# Altium project EVK-IRIS-W1-Mikro-Bus.PrjPcb (part 5 of 5)

## Sheet EVK-IRIS-W1-SRAM_RESET_STRAPING.SchDoc: Top Level Design
size A3; CompanyName: Rigado, LLC; Organization: Rigado; DocumentNumber: 11; SheetNumber: 11; SheetTotal: 14; Website: www.rigado.com; SheetSize: B
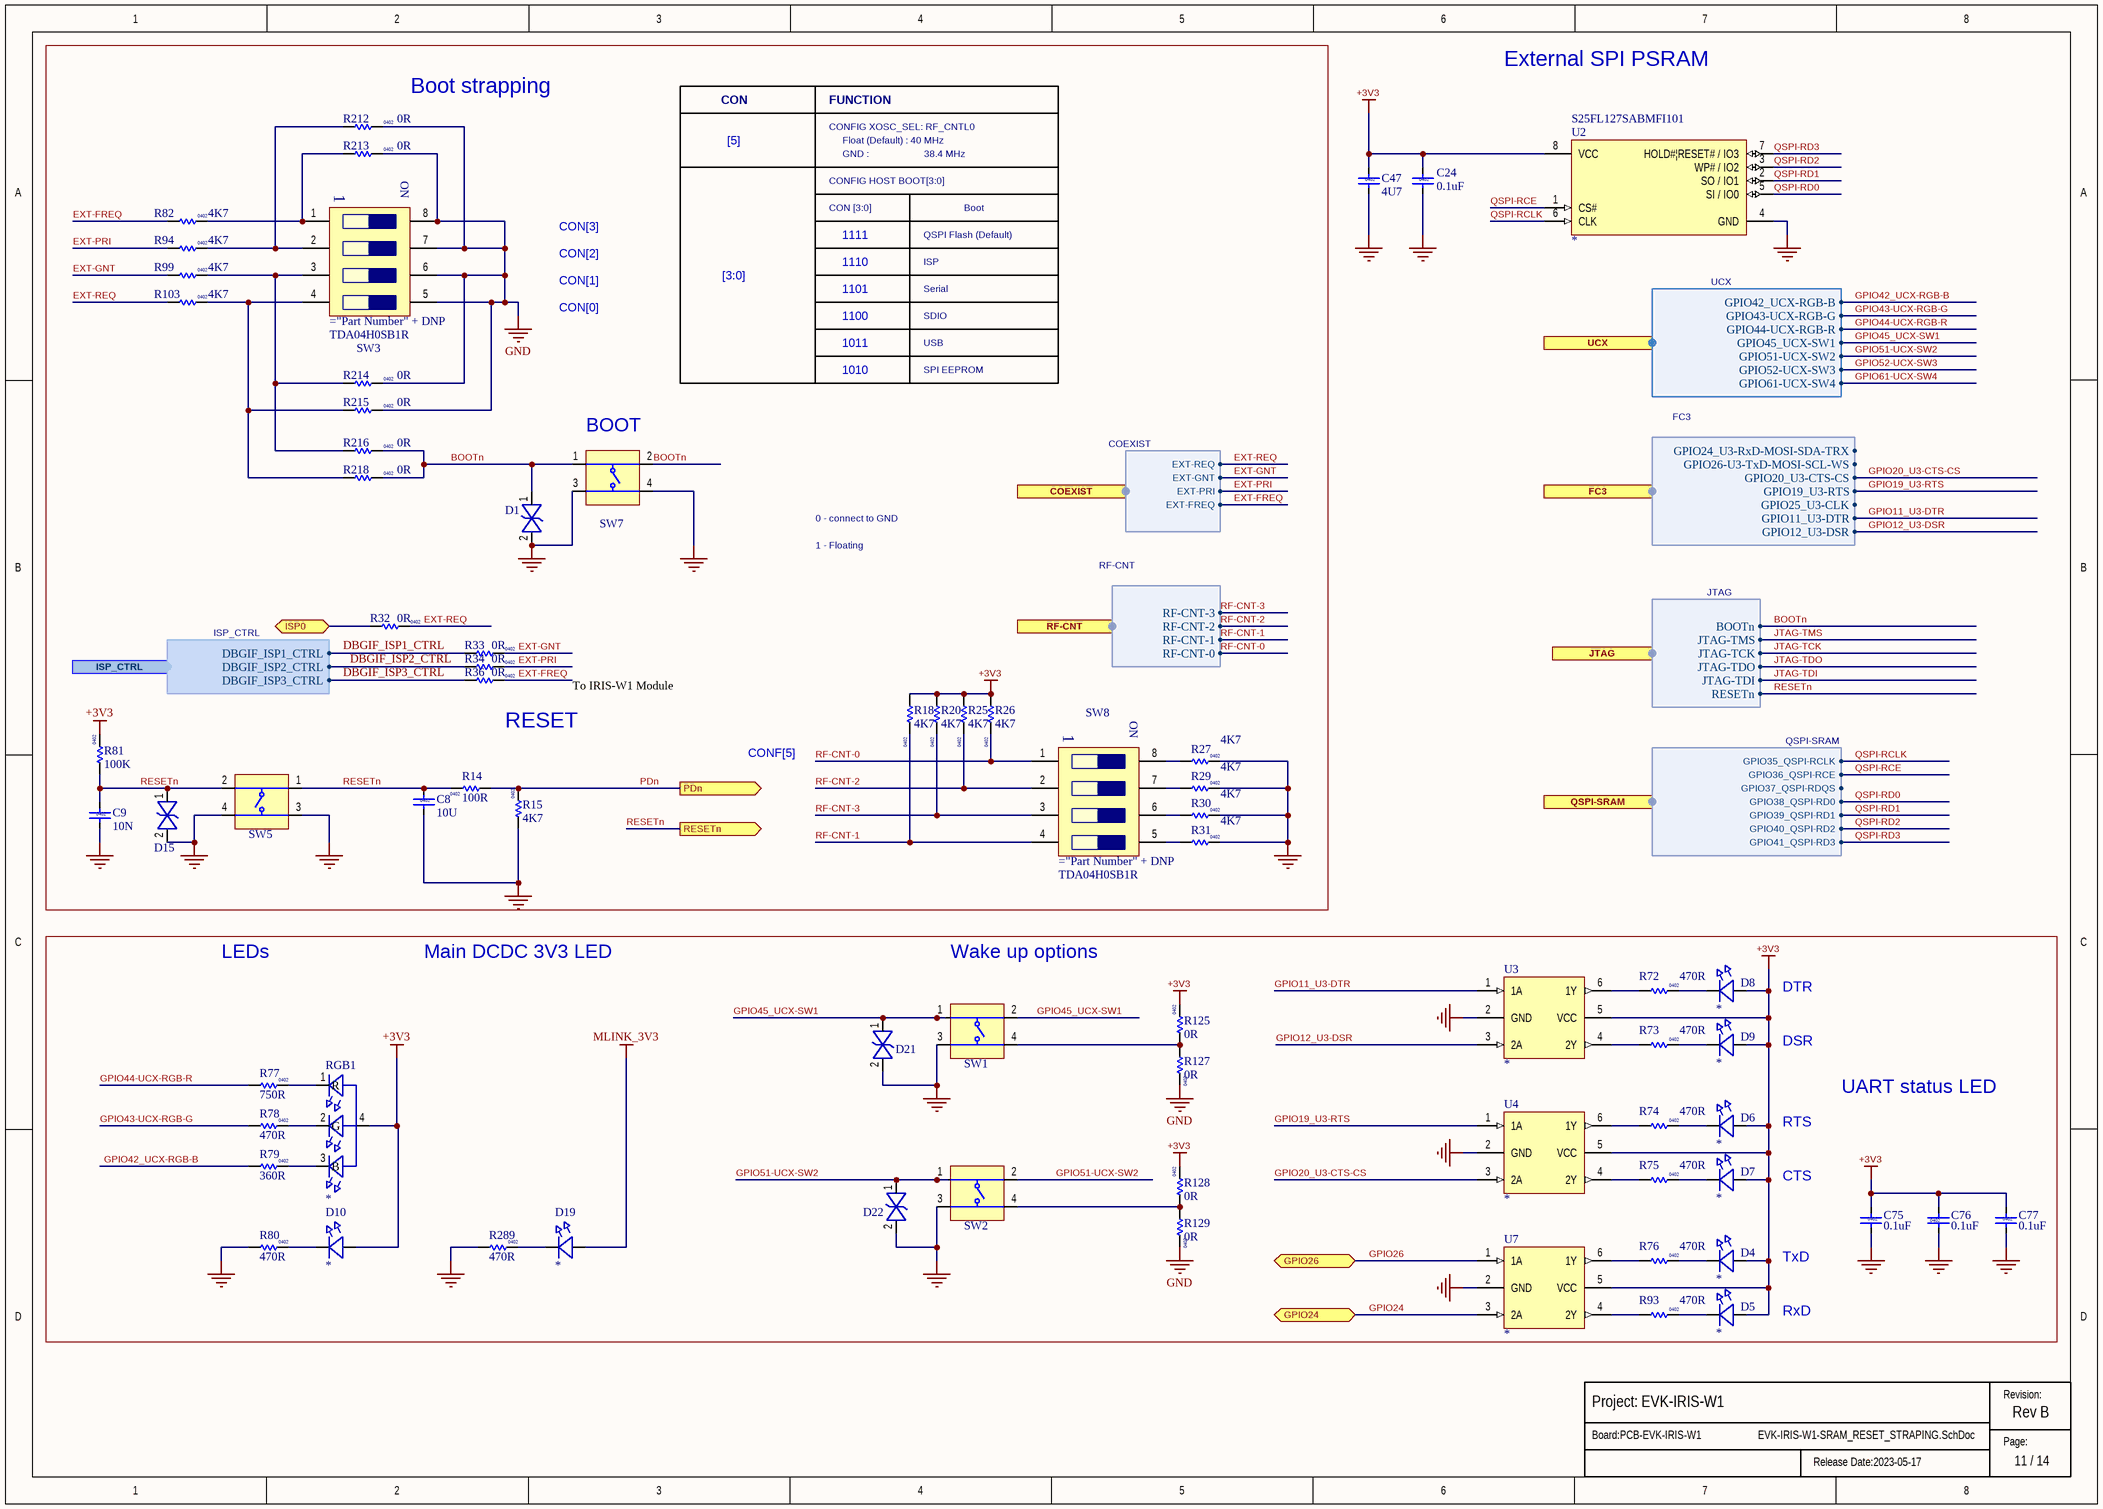
[diagram p13: EVK-IRIS-W1-SRAM_RESET_STRAPING.SchDoc]

### Parts
C8  value 10U  Size: 0402  [Cap 0402 HD]
C9  value 10N  Size: 0402  [Cap 0402]
C24  value 0.1uF  Size: 0402  [Cap 0402 HD]
C47  value 4U7  Size: 0402  [Cap 0402 HD]
C75  value 0.1uF  Size: 0402  [Cap 0402 HD]
C76  value 0.1uF  Size: 0402  [Cap 0402 HD]
C77  value 0.1uF  Size: 0402  [Cap 0402 HD]
D1  (no value)  [SOD-923]
D4  (no value)  [LED-0603]
D5  (no value)  [LED-0603]
D6  (no value)  [LED-0603]
D7  (no value)  [LED-0603]
D8  (no value)  [LED-0603]
D9  (no value)  [LED-0603]
D10  (no value)  [LED-0603]
D15  (no value)  [SOD-923]
D19  (no value)  [LED-0603]
D21  (no value)  [SOD-923]
D22  (no value)  [SOD-923]
R14  value 100R  Size: 0402  [RES 0402 HD]
R15  value 4K7  Size: 0402  [RES 0402 HD]
R18  value 4K7  Size: 0402  [RES 0402 HD]
R20  value 4K7  Size: 0402  [RES 0402 HD]
R25  value 4K7  Size: 0402  [RES 0402 HD]
R26  value 4K7  Size: 0402  [RES 0402 HD]
R27  value 4K7  Size: 0402  [RES 0402 HD]
R29  value 4K7  Size: 0402  [RES 0402 HD]
R30  value 4K7  Size: 0402  [RES 0402 HD]
R31  value 4K7  Size: 0402  [RES 0402 HD]
R32  value 0R  Size: 0402  [RES 0402 HD]
R33  value 0R  Size: 0402  [RES 0402 HD]
R34  value 0R  Size: 0402  [RES 0402 HD]
R36  value 0R  Size: 0402  [RES 0402 HD]
R72  value 470R  Size: 0402  [RES 0402 HD]
R73  value 470R  Size: 0402  [RES 0402 HD]
R74  value 470R  Size: 0402  [RES 0402 HD]
R75  value 470R  Size: 0402  [RES 0402 HD]
R76  value 470R  Size: 0402  [RES 0402 HD]
R77  value 750R  Size: 0402  [RES 0402 HD]
R78  value 470R  Size: 0402  [RES 0402 HD]
R79  value 360R  Size: 0402  [RES 0402 HD]
R80  value 470R  Size: 0402  [RES 0402 HD]
R81  value 100K  Size: 0402  [RES 0402 HD]
R82  value 4K7  Size: 0402  [RES 0402 HD]
R93  value 470R  Size: 0402  [RES 0402 HD]
R94  value 4K7  Size: 0402  [RES 0402 HD]
R99  value 4K7  Size: 0402  [RES 0402 HD]
R103  value 4K7  Size: 0402  [RES 0402 HD]
R125  value 0R  Size: 0402  [RES 0402 HD]
R127  value 0R  Size: 0402  [RES 0402 HD]
R128  value 0R  Size: 0402  [RES 0402 HD]
R129  value 0R  Size: 0402  [RES 0402 HD]
R212  value 0R  Size: 0402  [RES 0402 HD]
R213  value 0R  Size: 0402  [RES 0402 HD]
R214  value 0R  Size: 0402  [RES 0402 HD]
R215  value 0R  Size: 0402  [RES 0402 HD]
R216  value 0R  Size: 0402  [RES 0402 HD]
R218  value 0R  Size: 0402  [RES 0402 HD]
R289  value 470R  Size: 0402  [RES 0402 HD]
RGB1  (no value)  [LED_1616]
SW1  (no value)  [SW_TACT_SMT_6mm]
SW2  (no value)  [SW_TACT_SMT_6mm]
SW3  (no value)  [SOP1.27P6.2x6.2-8Pin]
SW5  (no value)  [SW_TACT_SMT_6mm]
SW7  (no value)  [SW_TACT_SMT_6mm]
SW8  (no value)  [SOP1.27P6.2x6.2-8Pin]
U2  Manufacturer Part Number 1: S25FL127SABMFI101  [SOIC-8W]
U3  (no value)  [SC70-6]
U4  (no value)  [SC70-6]
U7  (no value)  [SC70-6]

### Ports
COEXIST (harness COEXIST), FC3 (harness FC3), GPIO24 (bidir), GPIO26 (bidir), ISP0 (bidir), ISP_CTRL (harness ISP_CTRL), JTAG (harness JTAG), PDn (out), QSPI-SRAM (harness QSPI-SRAM), RESETn (out), RF-CNT (harness RF-CNT), UCX (harness UCX)

### Harnesses
QSPI-SRAM: GPIO35_QSPI-RCLK, GPIO36_QSPI-RCE, GPIO37_QSPI-RDQS, GPIO38_QSPI-RD0, GPIO39_QSPI-RD1, GPIO40_QSPI-RD2, GPIO41_QSPI-RD3
COEXIST: EXT-REQ, EXT-GNT, EXT-PRI, EXT-FREQ
RF-CNT: RF-CNT-0, RF-CNT-1, RF-CNT-2, RF-CNT-3
ISP_CTRL: DBGIF_ISP1_CTRL, DBGIF_ISP2_CTRL, DBGIF_ISP3_CTRL
UCX: GPIO42_UCX-RGB-B, GPIO43-UCX-RGB-G, GPIO44-UCX-RGB-R, GPIO45_UCX-SW1, GPIO51-UCX-SW2, GPIO52-UCX-SW3, GPIO61-UCX-SW4
FC3: GPIO20_U3-CTS-CS, GPIO19_U3-RTS, GPIO24_U3-RxD-MOSI-SDA-TRX, GPIO26-U3-TxD-MOSI-SCL-WS, GPIO25_U3-CLK, GPIO11_U3-DTR, GPIO12_U3-DSR
JTAG: JTAG-TCK, JTAG-TDI, JTAG-TDO, JTAG-TMS, RESETn, BOOTn

### Nets
+3V3: C24.1 C47.1 C75.1 C76.1 C77.1 D4.2(A) D5.2(A) D6.2(A) D7.2(A) D8.2(A) D9.2(A) D10.2(A) R18.2 R20.2 R25.2 R26.2 R81.2 R125.2 R128.2 RGB1.4(A) U2.8(VCC) U3.5(VCC) U4.5(VCC) U7.5(VCC)
GND: C8.2 C9.2 C24.2 C47.2 C75.2 C76.2 C77.2 D1.2 D15.2 D21.2 D22.2 R15.1 R27.2 R29.2 R30.2 R31.2 R80.1 R127.2 R129.2 R212.2 R213.2 R214.2 R215.2 R289.1 SW1.3(T3) SW2.3(T3) SW3.5 SW3.6 SW3.7 SW3.8 SW5.3(T3) SW5.4(T3) SW7.3(T3) SW7.4(T3) U2.4(GND) U3.2(GND) U4.2(GND) U7.2(GND)
MLINK_3V3: D19.2(A)
BOOTn: D1.1 R216.2 R218.2 SW7.1(T1) SW7.2(T2) ; port JTAG.BOOTn
DBGIF_ISP0_CTRL: R32.1 ; port ISP0
DBGIF_ISP1_CTRL: R33.1 ; port ISP_CTRL.DBGIF_ISP1_CTRL
DBGIF_ISP2_CTRL: R34.1 ; port ISP_CTRL.DBGIF_ISP2_CTRL
DBGIF_ISP3_CTRL: R36.1 ; port ISP_CTRL.DBGIF_ISP3_CTRL
EXT-FREQ: R36.2 R82.1 ; port COEXIST.EXT-FREQ
EXT-GNT: R33.2 R99.1 ; port COEXIST.EXT-GNT
EXT-PRI: R34.2 R94.1 ; port COEXIST.EXT-PRI
EXT-REQ: R32.2 R103.1 ; port COEXIST.EXT-REQ
GPIO11_U3-DTR: U3.1(1A) ; port FC3.GPIO11_U3-DTR
GPIO12_U3-DSR: U3.3(2A) ; port FC3.GPIO12_U3-DSR
GPIO19_U3-RTS: U4.1(1A) ; port FC3.GPIO19_U3-RTS
GPIO20_U3-CTS-CS: U4.3(2A) ; port FC3.GPIO20_U3-CTS-CS
GPIO24: U7.3(2A) ; port GPIO24
GPIO26: U7.1(1A) ; port GPIO26
GPIO42_UCX-RGB-B: R79.1 ; port UCX.GPIO42_UCX-RGB-B
GPIO43-UCX-RGB-G: R78.1 ; port UCX.GPIO43-UCX-RGB-G
GPIO44-UCX-RGB-R: R77.1 ; port UCX.GPIO44-UCX-RGB-R
GPIO45_UCX-SW1: D21.1 SW1.1(T1) SW1.2(T2) ; port UCX.GPIO45_UCX-SW1
GPIO51-UCX-SW2: D22.1 SW2.1(T1) SW2.2(T2) ; port UCX.GPIO51-UCX-SW2
PDn: R14.1 R15.2 ; port PDn
QSPI-RCE: U2.1(CS#) ; port QSPI-SRAM.GPIO36_QSPI-RCE
QSPI-RCLK: U2.6(CLK) ; port QSPI-SRAM.GPIO35_QSPI-RCLK
QSPI-RD0: U2.5(SI_/_IO0) ; port QSPI-SRAM.GPIO38_QSPI-RD0
QSPI-RD1: U2.2(SO_/_IO1) ; port QSPI-SRAM.GPIO39_QSPI-RD1
QSPI-RD2: U2.3(WP#_/_IO2) ; port QSPI-SRAM.GPIO40_QSPI-RD2
QSPI-RD3: U2.7(HOLD#|RESET#_/_IO3) ; port QSPI-SRAM.GPIO41_QSPI-RD3
RESETn: C8.1 C9.1 D15.1 R14.2 R81.1 SW5.1(T1) SW5.2(T2) ; port RESETn, port JTAG.RESETn
RF-CNT-0: R26.1 SW8.1 ; port RF-CNT.RF-CNT-0
RF-CNT-1: R18.1 SW8.4 ; port RF-CNT.RF-CNT-1
RF-CNT-2: R25.1 SW8.2 ; port RF-CNT.RF-CNT-2
RF-CNT-3: R20.1 SW8.3 ; port RF-CNT.RF-CNT-3
NetD4_1: D4.1(C) R76.2
NetD5_1: D5.1(C) R93.2
NetD6_1: D6.1(C) R74.2
NetD7_1: D7.1(C) R75.2
NetD8_1: D8.1(C) R72.2
NetD9_1: D9.1(C) R73.2
NetD10_1: D10.1(C) R80.2
NetD19_1: D19.1(C) R289.2
NetR27_1: R27.1 SW8.8
NetR29_1: R29.1 SW8.7
NetR30_1: R30.1 SW8.6
NetR31_1: R31.1 SW8.5
NetR72_1: R72.1 U3.6(1Y)
NetR73_1: R73.1 U3.4(2Y)
NetR74_1: R74.1 U4.6(1Y)
NetR75_1: R75.1 U4.4(2Y)
NetR76_1: R76.1 U7.6(1Y)
NetR77_2: R77.2 RGB1.1(R)
NetR78_2: R78.2 RGB1.2(G)
NetR79_2: R79.2 RGB1.3(B)
NetR82_2: R82.2 R213.1 SW3.1
NetR93_1: R93.1 U7.4(2Y)
NetR94_2: R94.2 R212.1 SW3.2
NetR99_2: R99.2 R214.1 R216.1 SW3.3
NetR103_2: R103.2 R215.1 R218.1 SW3.4
NetR125_1: R125.1 R127.1 SW1.4(T3)
NetR128_1: R128.1 R129.1 SW2.4(T3)

### Notes on the sheet
- Boot strapping
- CON
- FUNCTION
- External SPI PSRAM
- [5]
- CONFIG XOSC_SEL: RF_CNTL0
- CONFIG HOST BOOT[3:0]
- Float (Default) : 40 MHz
- GND :                      38.4 MHz
- CON[3]
- CON [3:0]
- 1111
- QSPI Flash (Default)
- Boot
- CON[2]
- CON[1]
- CON[0]
- [3:0]
- 1110
- 1101
- 1100
- SDIO
- Serial
- ISP
- 1011
- 1010
- USB
- SPI EEPROM
- (near SW7) BOOT
- 0 - connect to GND
- 1 - Floating
- To IRIS-W1 Module
- RESET
- CONF[5]
- LEDs
- Main DCDC 3V3 LED
- Wake up options
- DTR
- DSR
- RTS
- UART status LED
- CTS
- TxD
- RxD
- Revision:
- Page:
- (in symbol 137-00012) ON

### Library data of the parts
C8 = UBXH01-0000244: CAP CER X5R 0402 10U 20% 10V; Manufacturer: Murata Manufacturing Company, Ltd.; Manufacturer P/N: GRM155R61A106ME11; Editor: dario.antonaz; Released by: jure.podmenik; Env: ROHS; Permitted Use: Volume Products; Perferred: PREF; Mfg P/N Status: Active; Mfg P/N Split: 0; Mfg P/N Released: Yes; Part Number: UBXH01-0000244; Tolerance: 20%; Max Voltage: 10V; Part Type: Capacitor; Release Data: 2016-03-11T16:15:50; UBX Wiki: https://wiki.u-blox.com/bin/view/Operations/PartDetails?index=24334; RefDes: C; Mfg P/N Datasheet: https://wiki.u-blox.com/bin/view/Generic/Docs/DocumentSummary?index=24333; Manufacturer 2: Samsung Electro-Mechanics; Manufacturer P/N 2: CL05A106MP5NUN; Mfg P/N Status 2: NRND; Mfg P/N Split 2: 0; Mfg P/N Released 2: Yes; Mfg P/N Datasheet 2: https://wiki.u-blox.com/bin/view/Generic/Docs/DocumentSummary?index=27636
C9 = UBXH01-0023025: CAP CER X7R 0402 10N 10% 16V; Manufacturer: Murata Manufacturing Company, Ltd.; Manufacturer P/N: GRM155R71C103KA01; Editor: roland.rust; Released by: anthony.gergis; Env: ROHS; Permitted Use: Volume Products; Perferred: PREF; Mfg P/N Status: NRND; Mfg P/N Split: 100; Mfg P/N Released: Yes; Part Number: UBXH01-0023025; Tolerance: 10%; Max Voltage: 16V; Min Operating Temp: -55°C; Max Operating Temp: 125°C; Part Type: Capacitor; Release Data: 2021-02-16T13:14:11; UBX Wiki: https://wiki.u-blox.com/bin/view/Operations/PartDetails?index=5491; RefDes: C; Manufacturer 2: Samsung Electro-Mechanics; Manufacturer P/N 2: CL05B103KO5NNNC; Mfg P/N Status 2: Active; Mfg P/N Split 2: 0; Mfg P/N Released 2: Yes; Mfg P/N Datasheet 2: https://wiki.u-blox.com/bin/view/Generic/Docs/DocumentSummary?index=28567
C24 C75-C77 = 120-00016: Cap, Ceramic 0.1uF 10V 10% X5R 0402; Part Name: CAP CER 0.1UF 10V 10% X5R 0402; Manufacturer 1: Murata Electronics North America; Manufacturer Part Number 1: GRM155R61A104KA01J; Tolerance: +/- 10%; Use in new designs: Yes; UBX Code: None; Item Phase: In Production; Part Number: 120-00016; Revision: 0A; Supplier 1: Digi-Key; Supplier Part Number 1: 490-6297-1-ND; Manufacturer 2: Yageo; Supplier 2: Digi-Key; Supplier Part Number 2: 311-1336-1-ND; Height: 0.55mm; Pins: 2; Temperature Coefficient: X5R; Voltage: 10V; Max Operating Temp: 85; Manufacturer Part Number 2: CC0402KRX5R6BB104; Min Operating Temp: -55
C47 = UBXH01-0000243: CAP CER X5R 0402 4U7 20% 10V; Manufacturer: Murata Manufacturing Company, Ltd.; Manufacturer P/N: GRM155R61A475MEAA; Editor: martin.pilik; Released by: fabrice.bret-dibat; Env: GREEN; Permitted Use: Volume Products; Perferred: PREF; Mfg P/N Status: Active; Mfg P/N Split: 100; Mfg P/N Released: Yes; Part Number: UBXH01-0000243; Tolerance: 20%; Max Voltage: 10V; Min Operating Temp: -40°C; Max Operating Temp: 85°C; Part Type: Capacitor; Release Data: 2021-05-10T12:57:47; UBX Wiki: https://wiki.u-blox.com/bin/view/Operations/PartDetails?index=24303; RefDes: C; Mfg P/N Datasheet: https://wiki.u-blox.com/bin/view/Generic/Docs/DocumentSummary?index=24302
D1 D15 D21 D22 = 110-00019: Diode, ESD9B, 3.3V, ST5G, SOD-923; Part Name: Diode TVS 3.3V SOD-923; Manufacturer 1: ON Semiconductor; Manufacturer Part Number 1: ESD9B3.3ST5G; Body Size: 0.8mm x 0.6mm; Use in new designs: Yes; UBX Code: None; Item Phase: In Production; Part Number: 110-00019; Supplier 1: Digi-Key; Supplier Part Number 1: ESD9B3.3ST5GOSCT-ND; Height: 0.4mm; MFG Package: SOD-923; Pins: 2; Voltage: 3.3V; Manufacturer 2: ON Semiconductor; Max Operating Temp: 150; Supplier 2: Arrow; Supplier Part Number 2: ESD9B3.3ST5G; Manufacturer Part Number 2: ESD9B3.3ST5G; Current: None; Min Operating Temp: -55; Revision: 0A
D4-D10 D19 = UBXH11-0000018: LED CHIP 0603 LOW CURRENT OSRAM 0.002A GREEN 2.2V 2mA; Manufacturer P/N: LG L29K-G2J1-24; Editor: johann.furrer; Released by: martin.grasse; Env: ROHS; Permitted Use: Volume Products; Perferred: PREF; Mfg P/N Status: Active; Mfg P/N Split: 100; Mfg P/N Released: Yes; Color: *; Part Number: UBXH11-0000018; Value: GREEN; Max Voltage: 2.2V; Max Current: 2mA; Size: 0603; Min Operating Temp: -40°C; Max Operating Temp: 85°C; Part Type: LED; Release Data: 2018-01-09T15:31:38; UBX Wiki: https://wiki.u-blox.com/bin/view/Operations/PartDetails?index=20619; RefDes: DS; Manufacturer: Osram; Mfg P/N Datasheet: https://wiki.u-blox.com/bin/view/Generic/Docs/DocumentSummary?index=20620
R14 = UBXH18-0000504: RES THIN FILM CHIP 0402 100R 0.1% 100mW; Manufacturer: YAGEO; Manufacturer P/N: RT0402BRD07100RL; Editor: martin.kessel; Env: ROHS; Permitted Use: Internal Use; Perferred: PREF; Mfg P/N Status: Active; Mfg P/N Split: 100; Mfg P/N Released: No; Part Number: UBXH18-0000504; Tolerance: 0.1%; Max Power: 100mW; Min Operating Temp: -55°C; Max Operating Temp: 155°C; Part Type: Resistor; UBX Wiki: https://wiki.u-blox.com/bin/view/Operations/PartDetails?index=31120; RefDes: R; Mfg P/N Datasheet: https://wiki.u-blox.com/bin/view/Generic/Docs/DocumentSummary?index=19276
R15 R18 R20 R25-R27 R29-R31 R82 R94 R99 R103 = UBXH18-0000213: RES THICK FILM CHIP 0402 4K7 1% 63mW; Manufacturer: KOA; Manufacturer P/N: RK73H1ETTP4701F; Editor: michael.hein; Released by: vasyl.dykyy; Env: ROHS; Permitted Use: Volume Products; Perferred: PREF; Mfg P/N Status: Active; Mfg P/N Split: 100; Mfg P/N Released: Yes; Part Number: UBXH18-0000213; Tolerance: 1%; Max Power: 63mW; Part Type: Resistor; Release Data: 2015-10-02T11:47:33; Automotive: Yes; UBX Wiki: https://wiki.u-blox.com/bin/view/Operations/PartDetails?index=23300; RefDes: R; Mfg P/N Datasheet: https://wiki.u-blox.com/bin/view/Generic/Docs/DocumentSummary?index=8222
R32-R34 R36 R125 R127-R129 R212-R216 R218 = UBXH18-0003002: RES THICK FILM CHIP 0402 0R 0 100mW; Manufacturer: KOA; Manufacturer P/N: RK73Z1ETTD; Tolerance: 0; Editor: charlotte.biber; Released by: peter.mueller; Env: ROHS; Permitted Use: Volume Products; Perferred: PREF; Mfg P/N Status: NRND; Mfg P/N Split: 100; Mfg P/N Released: Yes; Part Number: UBXH18-0003002; Manufacturer 2: YAGEO; Max Power: 100mW; Part Type: Resistor; Release Data: 2012-06-05T09:49:55; UBX Wiki: https://wiki.u-blox.com/bin/view/Operations/PartDetails?index=6611; RefDes: R; Manufacturer P/N 2: 2322_705_91001_L; Mfg P/N Status 2: NRND; Mfg P/N Split 2: 0; Mfg P/N Released 2: Yes
R72-R76 R78 R80 R93 R289 = UBXH18-0008041: RES THICK FILM CHIP 0402 470R 5% 100mW; Manufacturer: ROHM; Manufacturer P/N: MCR01MZPJ471; Editor: roland.rust; Env: ROHS; Permitted Use: Volume Products; Perferred: PREF; Mfg P/N Status: Active; Mfg P/N Split: 100; Mfg P/N Released: Yes; Part Number: UBXH18-0008041; Tolerance: 5%; Max Power: 100mW; Part Type: Resistor; Released by: roland.rust; Release Data: 2009-04-24T14:36:39; UBX Wiki: https://wiki.u-blox.com/bin/view/Operations/PartDetails?index=6926; RefDes: R; Manufacturer 2: KOA; Manufacturer P/N 2: RK73B1ETTP471J; Mfg P/N Status 2: Active; Mfg P/N Split 2: 0; Mfg P/N Released 2: Yes; Manufacturer 3: YAGEO; Manufacturer P/N 3: 2322_705_87471_L; Mfg P/N Status 3: NRND; Mfg P/N Split 3: 0; Mfg P/N Released 3: Yes
R77 = UBXH18-0008046: RES THICK FILM CHIP 0402 750R 5% 100mW; Manufacturer: Panasonic; Manufacturer P/N: ERJ2GEJ751X; Editor: jaka.bevk; Released by: erian.bezhani; Env: ROHS; Permitted Use: Volume Products; Perferred: PREF; Mfg P/N Status: Active; Mfg P/N Split: 100; Mfg P/N Released: Yes; Part Number: UBXH18-0008046; Tolerance: 5%; Max Power: 100mW; Part Type: Resistor; Release Data: 2014-10-03T09:31:33; UBX Wiki: https://wiki.u-blox.com/bin/view/Operations/PartDetails?index=6935; RefDes: R; Mfg P/N Datasheet: https://wiki.u-blox.com/bin/view/Generic/Docs/DocumentSummary?index=21267
R79 = UBXH18-0000216: RES THICK FILM CHIP 0402 360R 1% 63mW; Manufacturer: KOA; Manufacturer P/N: RK73H1ETTP3600F; Editor: michael.hein; Released by: vasyl.dykyy; Env: ROHS; Permitted Use: Volume Products; Perferred: PREF; Mfg P/N Status: Active; Mfg P/N Split: 100; Mfg P/N Released: Yes; Part Number: UBXH18-0000216; Tolerance: 1%; Max Power: 63mW; Part Type: Resistor; Release Data: 2015-10-02T11:55:45; Automotive: Yes; UBX Wiki: https://wiki.u-blox.com/bin/view/Operations/PartDetails?index=23306; RefDes: R; Mfg P/N Datasheet: https://wiki.u-blox.com/bin/view/Generic/Docs/DocumentSummary?index=8222
R81 = UBXH18-0008097: RES THICK FILM CHIP 0402 100K 5% 100mW; Manufacturer: YAGEO; Manufacturer P/N: 2322_705_70104_L; Editor: roland.rust; Env: ROHS; Permitted Use: Volume Products; Perferred: PREF; Mfg P/N Status: NRND; Mfg P/N Split: 100; Mfg P/N Released: Yes; Part Number: UBXH18-0008097; Tolerance: 5%; Max Power: 100mW; Part Type: Resistor; Released by: roland.rust; Release Data: 2005-07-22T13:59:44; UBX Wiki: https://wiki.u-blox.com/bin/view/Operations/PartDetails?index=7020; RefDes: R; Manufacturer 2: KOA; Manufacturer P/N 2: RK73B1ETTD104J; Mfg P/N Status 2: NRND; Mfg P/N Split 2: 0; Mfg P/N Released 2: Yes
RGB1 = 115-00026: LED RGB SMT 0606; Manufacturer 1: Lite-On Inc; Manufacturer Part Number 1: LTST-C19HE1WT; Body Size: 1.6mm x 1.6mm; Current: 20mA; Item Phase: In Production; MFG Package: 0606; Use in new designs: Yes; Voltage: None; Color: *; Part Number: 115-00026; Supplier 1: Digi-Key; Supplier Part Number 1: 160-2162-1-ND; Height: 0.35mm; Max Operating Temp: 80; Min Operating Temp: -20; Part Name: LED RGB SMT 0606; Pins: 4; Revision: 0B; Size: Other; UBX Code: None; Manufacturer 2: QT Brightek (QTB); Manufacturer Part Number 2: QBLP600-RGB; Supplier 2: Digi-Key; Supplier Part Number 2: 1516-1184-1-ND
SW1 SW2 SW5 SW7 = 135-00002: Tactile Switch, SPST-NO, SMT, Actuation force = 160g, 6mm x 6mm; Part Name: Button Tactile SPST-NO 50mA 6mm SMT; Manufacturer 1: C&K Components; Manufacturer Part Number 1: PTS645SM43SMTR92 LFS; Current: 50mA; Use in new designs: Yes; Voltage: 12VDC; UBX Code: None; Item Phase: In Production; Part Number: 135-00002; Supplier 1: Digi-Key; Supplier Part Number 1: CKN9112CT-ND; Body Size: 6mm x 6mm; Height: 4.4mm; Pins: 4; Revision: 0B; Manufacturer 2: Seeed Technology; Supplier 2: Seeed Technology; Supplier Part Number 2: Rigado 135-00002; Max Operating Temp: 60; Min Operating Temp: -20; Manufacturer Part Number 2: Rigado 135-00002
SW3 SW8 = 137-00012: Dip Switch SPST 4 Position Surface Mount Slide (Standard) Actuator 25mA 24VDC; Manufacturer 1: C&K Components; Item_Phase: Pre-Production; Component Mounting Type: SMT; Switch/Button Function: On-Off; Use in new designs: Yes; Voltage: 24V; Item Phase: Unreleased; UBX Code: None; Part Number: 137-00012; Part Name: TDA04H0SB1R; Part_Type: Switch; Revision: A; Supplier 1: Digi-Key; Supplier Part Number 1: CKN9502TR-ND; Arena Link: https://app.bom.com/a/4M5DJQ9Q9SR7OCE3?v=spec.summary; Current: 25mA; Height: 2.35mm; Length: 6.2mm; Pins: 8; Switch/Button Circuit: SPST; Width: 6.2mm; Manufacturer Part Number 1: TDA04H0SB1R; Max Operating Temp: 85; Min Operating Temp: -40; Manufacturer 2: None; Manufacturer Part Number 2: None; Supplier 2: None; Supplier Part Number 2: None
U2 = 240-00017: IC, Flash 128MBIT, 108MHz, 8SOIC; Manufacturer 1: Cypress Semiconductor Corp; Part Name: IC Flash 128MBIT 108MHz 8SOIC; Body Size: 5.28mm x 5.28mm; Interface: SPI; Item Phase: Unreleased; Memory Type: Flash - NOR; MFG Package: 8-SOIC; SMT Pitch: 1.27mm; Thermal Pad: No; Use in new designs: Yes; Voltage: 3.6V; UBX Code: None; Manufacturer P/N: *; Part Number: 240-00017; Supplier 1: Digi-Key; Supplier Part Number 1: 1274-1045-ND; Height: 2.16mm; Memory Size: 128Mbit; Memory Speed: 108MHz; Max Operating Temp: 85; Min Operating Temp: -40; Pins: 8; Revision: None; Manufacturer 2: None; Manufacturer Part Number 2: None; Supplier 2: None; Supplier Part Number 2: None
U3 U4 U7 = 225-00022: Buffer, Non-Inverting 2 Element 1 Bit per Element Push-Pull Output SC-70-6; Manufacturer 1: Texas Instruments; Manufacturer Part Number 1: SN74LVC2G34DCKR; Part Name: IC BUF NON-INVERT 5.5V SC70-6; Body Size: 1.25mm x 2mm; Item Phase: In Production; SMT Pitch: 0.65mm; Thermal Pad: No; Use in new designs: Yes; Voltage: 5.5V; UBX Code: None; Manufacturer P/N: *; Part Number: 225-00022; Supplier 1: Digi-Key; Supplier Part Number 1: 296-13497-1-ND; Height: 1.1mm; Logic Type: Buffer; MFG Package: SC-70-6; Max Operating Temp: 125; Min Operating Temp: -40; Pins: 6; Revision: 0A; Manufacturer 2: ON Semiconductor; Manufacturer Part Number 2: NC7WZ16P6X; Supplier 2: Digi-Key; Supplier Part Number 2: NC7WZ16P6XCT-ND

## Nets that join several sheets
+1V8: EVK-IRIS-W1-PIN-HEADERS_SDIO-HEADER (J70.6), EVK-IRIS-W1-PowerSchDoc (J38.L7 J115.1)
+3V3: EVK-IRIS-W1-FTDI (21 pins), EVK-IRIS-W1-PIN-HEADERS_SDIO-HEADER (5 pins), EVK-IRIS-W1-PowerSchDoc (13 pins), EVK-IRIS-W1_MikroBuses (12 pins), EVK-IRIS-W1-RMII (26 pins), EVK-IRIS-W1-MCULINK-MUX (12 pins), EVK-IRIS-W1-DEBUG INTERFACE (5 pins), EVK-IRIS-W1-MCULINK_USB_DCDC (R211.2), EVK-IRIS-W1-SRAM_RESET_STRAPING (24 pins)
+VPA: EVK-IRIS-W1-PIN-HEADERS_SDIO-HEADER (J70.5), EVK-IRIS-W1-PowerSchDoc (J38.L8 J116.1)
Chassis-GND: EVK-IRIS-W1-PowerSchDoc (J72.SHLD J98.SHLD), EVK-IRIS-W1-RMII (C50.2 R137.2 T1.Shell), EVK-IRIS-W1-DEBUG INTERFACE (TP3.1 TP5.1), EVK-IRIS-W1-MCULINK_USB_DCDC (J101.SHLD)
GND: EVK-IRIS-W1-FC2_FC3_FC14_RMII (C73.2 C74.2), EVK-IRIS-W1-FTDI (40 pins), EVK-IRIS-W1-PIN-HEADERS_SDIO-HEADER (20 pins), EVK-IRIS-W1-PowerSchDoc (109 pins), EVK-IRIS-W1_MikroBuses (20 pins), EVK-IRIS-W1_MOD (C67.2 C68.2 J40.2 J41.2), EVK-IRIS-W1-RMII (35 pins), EVK-IRIS-W1-MCULINK-MUX (16 pins), EVK-IRIS-W1-MUCLINK (54 pins), EVK-IRIS-W1-DEBUG INTERFACE (26 pins), EVK-IRIS-W1-MCULINK_USB_DCDC (33 pins), EVK-IRIS-W1-SRAM_RESET_STRAPING (38 pins)
MCU_LINK_3V3: EVK-IRIS-W1-MUCLINK (21 pins), EVK-IRIS-W1-DEBUG INTERFACE (R220.1 R221.2), EVK-IRIS-W1-MCULINK_USB_DCDC (15 pins)
MLINK_3V3: EVK-IRIS-W1-MUCLINK (11 pins), EVK-IRIS-W1-MCULINK_USB_DCDC (8 pins), EVK-IRIS-W1-SRAM_RESET_STRAPING (D19.2)
MUSB-OTG_VBUS: EVK-IRIS-W1-PowerSchDoc (8 pins), EVK-IRIS-W1_MOD (J14.2)
VBUS: EVK-IRIS-W1-PowerSchDoc (7 pins), EVK-IRIS-W1-MCULINK_USB_DCDC (D16.2)
VBUS-OUT: EVK-IRIS-W1-PIN-HEADERS_SDIO-HEADER (J3.1 J4.1 J10.1 J70.1), EVK-IRIS-W1-PowerSchDoc (6 pins), EVK-IRIS-W1_MikroBuses (8 pins), EVK-IRIS-W1-MCULINK_USB_DCDC (C97.1 R151.2 U20.1 U20.6)
VCC_IF_LINK: EVK-IRIS-W1-MUCLINK (R186.1), EVK-IRIS-W1-DEBUG INTERFACE (R13.1 R217.2)
ADC0_CH1_CURR: EVK-IRIS-W1-MUCLINK (U13.14 U13.57), EVK-IRIS-W1-MCULINK_USB_DCDC (R241.1 R242.1)
ADC1_CH1_V: EVK-IRIS-W1-MUCLINK (U13.20), EVK-IRIS-W1-MCULINK_USB_DCDC (R239.1 R240.2)
BOOTn: EVK-IRIS-W1-FTDI (R7.2), EVK-IRIS-W1-SRAM_RESET_STRAPING (5 pins)
CRSDV: EVK-IRIS-W1-FC2_FC3_FC14_RMII (R281.1), EVK-IRIS-W1-RMII (R140.1)
CTRL_CAL_DISC: EVK-IRIS-W1-MUCLINK (U13.3), EVK-IRIS-W1-MCULINK_USB_DCDC (R231.1 R232.2)
CTRL_CAL_R1: EVK-IRIS-W1-MUCLINK (U13.41), EVK-IRIS-W1-MCULINK_USB_DCDC (R227.1 R228.2)
CTRL_CAL_R2: EVK-IRIS-W1-MUCLINK (U13.42), EVK-IRIS-W1-MCULINK_USB_DCDC (R229.1 R230.1)
CTRL_HIGH_CURR: EVK-IRIS-W1-MUCLINK (U13.22 U13.94), EVK-IRIS-W1-MCULINK_USB_DCDC (R233.1 R234.1)
CTRL_HIGH_CURR_DIS: EVK-IRIS-W1-MUCLINK (U13.92), EVK-IRIS-W1-MCULINK_USB_DCDC (R237.1 R238.1)
CTRL_HIGH_CURR_EN: EVK-IRIS-W1-MUCLINK (U13.8), EVK-IRIS-W1-MCULINK_USB_DCDC (R235.1 R236.2)
DBGIF_DETECT: EVK-IRIS-W1-MUCLINK (U13.78), EVK-IRIS-W1-DEBUG INTERFACE (R224.1)
DBGIF_ISP0_CTRL: EVK-IRIS-W1-MUCLINK (U13.72), EVK-IRIS-W1-DEBUG INTERFACE (R68.1 R217.1), EVK-IRIS-W1-SRAM_RESET_STRAPING (R32.1)
DBGIF_ISP1_CTRL: EVK-IRIS-W1-MUCLINK (U13.77), EVK-IRIS-W1-MCULINK_USB_DCDC (R243.1 R245.2), EVK-IRIS-W1-SRAM_RESET_STRAPING (R33.1)
DBGIF_ISP2_CTRL: EVK-IRIS-W1-MUCLINK (U13.68), EVK-IRIS-W1-MCULINK_USB_DCDC (R246.1 R247.1), EVK-IRIS-W1-SRAM_RESET_STRAPING (R34.1)
DBGIF_ISP3_CTRL: EVK-IRIS-W1-MUCLINK (U13.80), EVK-IRIS-W1-MCULINK_USB_DCDC (R248.1 R250.2), EVK-IRIS-W1-SRAM_RESET_STRAPING (R36.1)
DBGIF_RESET: EVK-IRIS-W1-MUCLINK (U13.90), EVK-IRIS-W1-DEBUG INTERFACE (R43.2)
DBGIF_RESET_TXEN: EVK-IRIS-W1-MUCLINK (U13.71), EVK-IRIS-W1-DEBUG INTERFACE (R221.1 R223.1)
DBGIF_TCK_SWCLK: EVK-IRIS-W1-MUCLINK (U13.54), EVK-IRIS-W1-DEBUG INTERFACE (R2.2 R296.2)
DBGIF_TDI: EVK-IRIS-W1-MUCLINK (U13.7), EVK-IRIS-W1-DEBUG INTERFACE (R292.2)
DBGIF_TDO_SWO: EVK-IRIS-W1-MUCLINK (U13.83), EVK-IRIS-W1-DEBUG INTERFACE (R290.2)
DBGIF_TMS_SWDIO: EVK-IRIS-W1-MUCLINK (U13.81), EVK-IRIS-W1-DEBUG INTERFACE (R12.2 R294.2)
DBGIF_TMS_SWDIO_TXEN: EVK-IRIS-W1-MUCLINK (U13.66), EVK-IRIS-W1-DEBUG INTERFACE (R219.1 R220.2)
EXT-FREQ: EVK-IRIS-W1-PIN-HEADERS_SDIO-HEADER (J3.3), EVK-IRIS-W1_MOD (J38.M14), EVK-IRIS-W1-SRAM_RESET_STRAPING (R36.2 R82.1)
EXT-GNT: EVK-IRIS-W1-PIN-HEADERS_SDIO-HEADER (J3.4), EVK-IRIS-W1_MOD (J38.M12), EVK-IRIS-W1-SRAM_RESET_STRAPING (R33.2 R99.1)
EXT-PRI: EVK-IRIS-W1-PIN-HEADERS_SDIO-HEADER (J4.3), EVK-IRIS-W1_MOD (J38.N14), EVK-IRIS-W1-SRAM_RESET_STRAPING (R34.2 R94.1)
EXT-REQ: EVK-IRIS-W1-PIN-HEADERS_SDIO-HEADER (J4.4), EVK-IRIS-W1_MOD (J38.N12), EVK-IRIS-W1-SRAM_RESET_STRAPING (R32.2 R103.1)
GPIO0_U0-CTS-CS-SDA: EVK-IRIS-W1-FTDI (R38.2), EVK-IRIS-W1-PIN-HEADERS_SDIO-HEADER (J3.5), EVK-IRIS-W1_MikroBuses (J29.3 J31.3), EVK-IRIS-W1_MOD (J38.M11)
GPIO1_U0-SPI-WP: EVK-IRIS-W1-FTDI (R41.2), EVK-IRIS-W1-PIN-HEADERS_SDIO-HEADER (J4.5), EVK-IRIS-W1_MOD (J38.N11)
GPIO2: EVK-IRIS-W1_MOD (J38.M10), EVK-IRIS-W1-MCULINK-MUX (U18.1)
GPIO2_FC0_MOSI_SPI_ML: EVK-IRIS-W1-MCULINK-MUX (U18.5), EVK-IRIS-W1-MUCLINK (U13.60)
GPIO2_U0-RxD-MOSI-SCL-TRX: EVK-IRIS-W1-FTDI (R9.2), EVK-IRIS-W1-PIN-HEADERS_SDIO-HEADER (J3.6), EVK-IRIS-W1_MikroBuses (J27.1 J84.1 J85.1), EVK-IRIS-W1-MCULINK-MUX (U18.7)
GPIO3: EVK-IRIS-W1_MOD (J38.N10), EVK-IRIS-W1-MCULINK-MUX (R259.2 R260.1)
GPIO3_FC0_MISO_SPI_ML: EVK-IRIS-W1-MCULINK-MUX (R259.1), EVK-IRIS-W1-MUCLINK (U13.62)
GPIO3_U0-TxD-MISO: EVK-IRIS-W1-FTDI (R37.2), EVK-IRIS-W1-PIN-HEADERS_SDIO-HEADER (J4.6), EVK-IRIS-W1_MikroBuses (J25.1 J80.1 J83.1), EVK-IRIS-W1-MCULINK-MUX (R260.2)
GPIO4: EVK-IRIS-W1_MOD (J38.M9), EVK-IRIS-W1-MCULINK-MUX (R261.1 R262.1)
GPIO4-FC0_SCK_SPI_ML: EVK-IRIS-W1-MCULINK-MUX (R261.2), EVK-IRIS-W1-MUCLINK (U13.61)
GPIO4-U0-CLK: EVK-IRIS-W1-FTDI (R8.2), EVK-IRIS-W1-PIN-HEADERS_SDIO-HEADER (J3.7), EVK-IRIS-W1_MikroBuses (J29.4 J31.4), EVK-IRIS-W1-MCULINK-MUX (R262.2)
GPIO5: EVK-IRIS-W1_MOD (J38.N9), EVK-IRIS-W1-MCULINK-MUX (U18.2)
GPIO5_FC0_SSELN1_SPI_ML: EVK-IRIS-W1-MCULINK-MUX (U18.4), EVK-IRIS-W1-MUCLINK (U13.74)
GPIO5_U0-RTS: EVK-IRIS-W1-PIN-HEADERS_SDIO-HEADER (J4.7), EVK-IRIS-W1-MCULINK-MUX (U18.6)
GPIO6_U1-CTS-CS: EVK-IRIS-W1-FC0_FC1_JTAG_UCX (J15.3), EVK-IRIS-W1_MikroBuses (J8.3 J9.3)
GPIO6_U1-CTS-CS_JTAG-TCK: EVK-IRIS-W1-FC0_FC1_JTAG_UCX (J15.2), EVK-IRIS-W1-PIN-HEADERS_SDIO-HEADER (J10.3), EVK-IRIS-W1_MOD (J38.B14)
GPIO7_U1-CLK: EVK-IRIS-W1-FC0_FC1_JTAG_UCX (J34.3), EVK-IRIS-W1_MikroBuses (J8.4 J9.4)
GPIO7_U1-CLK_JTAG-TMS: EVK-IRIS-W1-FC0_FC1_JTAG_UCX (J34.2), EVK-IRIS-W1-PIN-HEADERS_SDIO-HEADER (J70.3), EVK-IRIS-W1_MOD (J38.A14)
GPIO8_U1-TxD-MISO-SCL-WS: EVK-IRIS-W1-FC0_FC1_JTAG_UCX (J35.3), EVK-IRIS-W1_MikroBuses (J11.1 J16.1 J73.1)
GPIO8_U1-TxD-MISO-SCL-WS_JTAG-TDI: EVK-IRIS-W1-FC0_FC1_JTAG_UCX (J35.2), EVK-IRIS-W1-PIN-HEADERS_SDIO-HEADER (J10.4), EVK-IRIS-W1_MOD (J38.B12)
GPIO9_U1-RxD-MOSI-SDA-TRX: EVK-IRIS-W1-FC0_FC1_JTAG_UCX (J36.3), EVK-IRIS-W1_MikroBuses (J18.1 J76.1 J79.1)
GPIO9_U1-RxD-MOSI-SDA-TRX_JTAG-TDO: EVK-IRIS-W1-FC0_FC1_JTAG_UCX (J36.2), EVK-IRIS-W1-PIN-HEADERS_SDIO-HEADER (J70.4), EVK-IRIS-W1_MOD (J38.A12)
GPIO10_U1-RTS_JTAG-nRST: EVK-IRIS-W1-FC0_FC1_JTAG_UCX (J37.2), EVK-IRIS-W1-PIN-HEADERS_SDIO-HEADER (J10.5), EVK-IRIS-W1_MOD (J38.B11)
GPIO11_U3-DTR: EVK-IRIS-W1-FTDI (R57.2), EVK-IRIS-W1-PIN-HEADERS_SDIO-HEADER (J10.6), EVK-IRIS-W1_MOD (J38.A11), EVK-IRIS-W1-SRAM_RESET_STRAPING (U3.1)
GPIO12_U3-DSR: EVK-IRIS-W1-FTDI (R56.2), EVK-IRIS-W1-PIN-HEADERS_SDIO-HEADER (J10.7), EVK-IRIS-W1_MOD (J38.B10), EVK-IRIS-W1-SRAM_RESET_STRAPING (U3.3)
GPIO13: EVK-IRIS-W1_MOD (J38.A6), EVK-IRIS-W1-MCULINK-MUX (R143.1 U19.1)
GPIO13_SWCLK_ML: EVK-IRIS-W1-MCULINK-MUX (U19.5), EVK-IRIS-W1-DEBUG INTERFACE (J45.4 R2.1 R116.2)
GPIO13_U2-RxD-MOSI-SDA-RX: EVK-IRIS-W1-PIN-HEADERS_SDIO-HEADER (J47.2), EVK-IRIS-W1_MikroBuses (J28.1 J86.1 J87.1), EVK-IRIS-W1-MCULINK-MUX (R143.2 U19.7)
GPIO14: EVK-IRIS-W1_MOD (J38.B5), EVK-IRIS-W1-MCULINK-MUX (R142.1 U19.2)
GPIO14_SWDIO_ML: EVK-IRIS-W1-MCULINK-MUX (U19.4), EVK-IRIS-W1-DEBUG INTERFACE (J45.2 R12.1 R48.2)
GPIO14_U2-TxD-MISO-SCL-WS: EVK-IRIS-W1-PIN-HEADERS_SDIO-HEADER (J48.1), EVK-IRIS-W1_MikroBuses (J26.1 J81.1 J82.1), EVK-IRIS-W1-MCULINK-MUX (R142.2 U19.6)
GPIO15: EVK-IRIS-W1-FC2_FC3_FC14_RMII (J55.2), EVK-IRIS-W1-PowerSchDoc (J38.C6)
GPIO15_U2-CLK: EVK-IRIS-W1-FC2_FC3_FC14_RMII (J55.1), EVK-IRIS-W1-PIN-HEADERS_SDIO-HEADER (J47.5), EVK-IRIS-W1_MikroBuses (J1.4 J2.4)
GPIO16: EVK-IRIS-W1-FC2_FC3_FC14_RMII (J56.2), EVK-IRIS-W1-PowerSchDoc (J38.C8)
GPIO16_FC2-I2C-SDA-ML: EVK-IRIS-W1-MCULINK-MUX (U17.4), EVK-IRIS-W1-MUCLINK (U13.86)
GPIO16_U2-CTS-CS: EVK-IRIS-W1-PIN-HEADERS_SDIO-HEADER (J10.10), EVK-IRIS-W1_MikroBuses (J1.3 J2.3), EVK-IRIS-W1-MCULINK-MUX (U17.6)
GPIO17: EVK-IRIS-W1-FC2_FC3_FC14_RMII (J57.2), EVK-IRIS-W1-PowerSchDoc (J38.C7)
GPIO17_FC2-I2C-SCL-ML: EVK-IRIS-W1-MCULINK-MUX (U17.5), EVK-IRIS-W1-MUCLINK (U13.76)
GPIO17_U2-RTS: EVK-IRIS-W1-PIN-HEADERS_SDIO-HEADER (J47.1), EVK-IRIS-W1-MCULINK-MUX (U17.7)
GPIO18: EVK-IRIS-W1-FC2_FC3_FC14_RMII (J60.2), EVK-IRIS-W1-PowerSchDoc (J38.C9)
GPIO18__Mikro-INT0: EVK-IRIS-W1-FC2_FC3_FC14_RMII (J60.1), EVK-IRIS-W1-PIN-HEADERS_SDIO-HEADER (J47.4), EVK-IRIS-W1_MikroBuses (J62.1 J91.1 J92.1 J93.1)
GPIO18_SDIO-D2: EVK-IRIS-W1-FC2_FC3_FC14_RMII (J60.3), EVK-IRIS-W1-PIN-HEADERS_SDIO-HEADER (R83.1)
GPIO19_U3-RTS: EVK-IRIS-W1-FC2_FC3_FC14_RMII (J58.1), EVK-IRIS-W1-FTDI (R55.2), EVK-IRIS-W1-PIN-HEADERS_SDIO-HEADER (J48.6), EVK-IRIS-W1-SRAM_RESET_STRAPING (U4.1)
GPIO19_U3-RTS_SDIO-D0: EVK-IRIS-W1-FC2_FC3_FC14_RMII (J58.2), EVK-IRIS-W1_MOD (J38.B8)
GPIO20_U3-CTS-CS: EVK-IRIS-W1-FC2_FC3_FC14_RMII (J59.1), EVK-IRIS-W1-FTDI (R54.2), EVK-IRIS-W1-PIN-HEADERS_SDIO-HEADER (J48.7), EVK-IRIS-W1-SRAM_RESET_STRAPING (U4.3)
GPIO20_U3-CTS-CS_SDIO-D1: EVK-IRIS-W1-FC2_FC3_FC14_RMII (J59.2), EVK-IRIS-W1_MOD (J38.A9)
GPIO21_U0-SPI-HD: EVK-IRIS-W1-FTDI (R42.2), EVK-IRIS-W1-PIN-HEADERS_SDIO-HEADER (J44.5), EVK-IRIS-W1_MOD (R270.1)
GPIO22: EVK-IRIS-W1-FC2_FC3_FC14_RMII (R273.1), EVK-IRIS-W1-PIN-HEADERS_SDIO-HEADER (J43.8)
GPIO22/RMII-RxD0/XTAL32K_IN: EVK-IRIS-W1-FC2_FC3_FC14_RMII (R271.2 R272.2 R273.2), EVK-IRIS-W1_MOD (J38.J1)
GPIO23: EVK-IRIS-W1-FC2_FC3_FC14_RMII (R269.1), EVK-IRIS-W1-PIN-HEADERS_SDIO-HEADER (J44.8)
GPIO23/RMII-RxD1XTAL32K_OUT: EVK-IRIS-W1-FC2_FC3_FC14_RMII (R267.2 R268.2 R269.2), EVK-IRIS-W1_MOD (J38.J2)
GPIO24: EVK-IRIS-W1_MOD (J38.B9), EVK-IRIS-W1-MCULINK-MUX (R134.2 U16.2), EVK-IRIS-W1-SRAM_RESET_STRAPING (U7.3)
GPIO24_FC3-UART-RXD-ML: EVK-IRIS-W1-MCULINK-MUX (U16.6), EVK-IRIS-W1-MUCLINK (U13.79)
GPIO24_U3-RxD-MOSI-SDA-TRX: EVK-IRIS-W1-FTDI (R52.2), EVK-IRIS-W1-PIN-HEADERS_SDIO-HEADER (J47.3), EVK-IRIS-W1-MCULINK-MUX (R134.1 U16.4)
GPIO25_U3-CLK: EVK-IRIS-W1-FC2_FC3_FC14_RMII (R282.1), EVK-IRIS-W1-PIN-HEADERS_SDIO-HEADER (J48.8)
GPIO25_U3-CLK_RMII-RFECLK: EVK-IRIS-W1-FC2_FC3_FC14_RMII (R279.2 R282.2), EVK-IRIS-W1_MOD (J38.F3)
GPIO26: EVK-IRIS-W1_MOD (J38.A10), EVK-IRIS-W1-MCULINK-MUX (R136.1 U16.1), EVK-IRIS-W1-SRAM_RESET_STRAPING (U7.1)
GPIO26-FC3-UART-TXD-ML: EVK-IRIS-W1-MCULINK-MUX (U16.7), EVK-IRIS-W1-MUCLINK (U13.70)
GPIO26-U3-TxD-MISO-SCL-WS: EVK-IRIS-W1-FTDI (R53.2), EVK-IRIS-W1-PIN-HEADERS_SDIO-HEADER (J48.2), EVK-IRIS-W1-MCULINK-MUX (R136.2 U16.5)
GPIO27-PWM5: EVK-IRIS-W1-PIN-HEADERS_SDIO-HEADER (J48.3), EVK-IRIS-W1_MikroBuses (J61.1 J88.1 J89.1 J90.1), EVK-IRIS-W1_MOD (J38.E2)
GPIO29_QSPI-FDQS: EVK-IRIS-W1-PIN-HEADERS_SDIO-HEADER (J10.9), EVK-IRIS-W1_MOD (J38.D2)
GPIO42_UCX-RGB-B: EVK-IRIS-W1-PIN-HEADERS_SDIO-HEADER (J3.8), EVK-IRIS-W1_MOD (J38.M8), EVK-IRIS-W1-SRAM_RESET_STRAPING (R79.1)
GPIO43-UCX-RGB-G: EVK-IRIS-W1-PIN-HEADERS_SDIO-HEADER (J4.8), EVK-IRIS-W1_MOD (J38.N8), EVK-IRIS-W1-SRAM_RESET_STRAPING (R78.1)
GPIO44-UCX-RGB-R: EVK-IRIS-W1-PIN-HEADERS_SDIO-HEADER (J3.9), EVK-IRIS-W1_MOD (J38.M7), EVK-IRIS-W1-SRAM_RESET_STRAPING (R77.1)
GPIO45_UCX-SW1: EVK-IRIS-W1-PIN-HEADERS_SDIO-HEADER (J4.9), EVK-IRIS-W1_MOD (J38.N7), EVK-IRIS-W1-SRAM_RESET_STRAPING (D21.1 SW1.1 SW1.2)
GPIO46: EVK-IRIS-W1-PIN-HEADERS_SDIO-HEADER (J48.9), EVK-IRIS-W1_MikroBuses (J8.1 J9.1), EVK-IRIS-W1_MOD (J38.M6)
GPIO47: EVK-IRIS-W1-PIN-HEADERS_SDIO-HEADER (J43.1), EVK-IRIS-W1_MikroBuses (J1.1 J2.1), EVK-IRIS-W1_MOD (J38.N6)
GPIO48: EVK-IRIS-W1-PIN-HEADERS_SDIO-HEADER (J44.1), EVK-IRIS-W1_MikroBuses (J29.1 J31.1), EVK-IRIS-W1_MOD (J38.M5)
GPIO49: EVK-IRIS-W1-PIN-HEADERS_SDIO-HEADER (J43.2), EVK-IRIS-W1_MikroBuses (J21.1 J23.1), EVK-IRIS-W1_MOD (J38.N5)
GPIO50_Mikro-Reset: EVK-IRIS-W1-PIN-HEADERS_SDIO-HEADER (J44.2), EVK-IRIS-W1_MikroBuses (R19.1 R21.1 R70.1 R71.1), EVK-IRIS-W1_MOD (J38.M4)
GPIO51-UCX-SW2: EVK-IRIS-W1-PIN-HEADERS_SDIO-HEADER (J43.3), EVK-IRIS-W1_MOD (J38.N4), EVK-IRIS-W1-SRAM_RESET_STRAPING (D22.1 SW2.1 SW2.2)
GPIO52-UCX-SW3: EVK-IRIS-W1-PIN-HEADERS_SDIO-HEADER (J44.3), EVK-IRIS-W1_MOD (J38.M3)
GPIO53_U14-CTS-CS: EVK-IRIS-W1-PIN-HEADERS_SDIO-HEADER (J43.10), EVK-IRIS-W1_MikroBuses (J21.3 J23.3), EVK-IRIS-W1_MOD (J38.N3)
GPIO54_U14-CLK: EVK-IRIS-W1-PIN-HEADERS_SDIO-HEADER (J43.4), EVK-IRIS-W1_MikroBuses (J21.4 J23.4), EVK-IRIS-W1_MOD (J38.N2)
GPIO55_U14-RTS: EVK-IRIS-W1-FC2_FC3_FC14_RMII (R115.1), EVK-IRIS-W1-PIN-HEADERS_SDIO-HEADER (J44.9)
GPIO55_U14-RTS_RMII-INT: EVK-IRIS-W1-FC2_FC3_FC14_RMII (R111.2 R115.2), EVK-IRIS-W1_MOD (J38.L4)
GPIO56_U14-TxD-MISO-SCL-WS: EVK-IRIS-W1-FC2_FC3_FC14_RMII (R264.1), EVK-IRIS-W1-PIN-HEADERS_SDIO-HEADER (J48.5), EVK-IRIS-W1_MikroBuses (J17.1 J74.1 J75.1)
GPIO56_U14-TxD-MISO-SCL-WS_RMII-MDC: EVK-IRIS-W1-FC2_FC3_FC14_RMII (R263.2 R264.2), EVK-IRIS-W1_MOD (J38.L2)
GPIO57_U14-RxD-MOSI-SDA-TRX: EVK-IRIS-W1-FC2_FC3_FC14_RMII (R266.1), EVK-IRIS-W1-PIN-HEADERS_SDIO-HEADER (J48.4), EVK-IRIS-W1_MikroBuses (J19.1 J77.1 J78.1)
GPIO57_U14-RxD-MOSI-SDA-TRX_RMII-MDIO: EVK-IRIS-W1-FC2_FC3_FC14_RMII (R265.2 R266.2), EVK-IRIS-W1_MOD (J38.L1)
GPIO58: EVK-IRIS-W1-FC2_FC3_FC14_RMII (R277.1), EVK-IRIS-W1-PIN-HEADERS_SDIO-HEADER (J43.7)
GPIO58_RMII-TxD0: EVK-IRIS-W1-FC2_FC3_FC14_RMII (R275.2 R277.2), EVK-IRIS-W1_MOD (J38.K1)
GPIO59: EVK-IRIS-W1-FC2_FC3_FC14_RMII (R278.1), EVK-IRIS-W1-PIN-HEADERS_SDIO-HEADER (J44.7)
GPIO59_RMII-TxD1: EVK-IRIS-W1-FC2_FC3_FC14_RMII (R276.2 R278.2), EVK-IRIS-W1_MOD (J38.K2)
GPIO60: EVK-IRIS-W1-FC2_FC3_FC14_RMII (R283.1), EVK-IRIS-W1-PIN-HEADERS_SDIO-HEADER (J44.6)
GPIO60_RMII-TxEN: EVK-IRIS-W1-FC2_FC3_FC14_RMII (R280.2 R283.2), EVK-IRIS-W1_MOD (J38.J3)
GPIO61-UCX-SW4: EVK-IRIS-W1-PIN-HEADERS_SDIO-HEADER (J44.4), EVK-IRIS-W1_MOD (J38.K3)
GPIO62: EVK-IRIS-W1-FC2_FC3_FC14_RMII (R284.1), EVK-IRIS-W1-PIN-HEADERS_SDIO-HEADER (J43.6)
GPIO62_RMII-CRSDV: EVK-IRIS-W1-FC2_FC3_FC14_RMII (R281.2 R284.2), EVK-IRIS-W1_MOD (J38.M1)
GPIO63: EVK-IRIS-W1-FC2_FC3_FC14_RMII (R286.1), EVK-IRIS-W1-PIN-HEADERS_SDIO-HEADER (J43.5)
GPIO63_RMII-RxERR: EVK-IRIS-W1-FC2_FC3_FC14_RMII (R285.2 R286.2), EVK-IRIS-W1_MOD (J38.N1)
INT: EVK-IRIS-W1-FC2_FC3_FC14_RMII (R111.1), EVK-IRIS-W1-RMII (R149.1)
JTAG-TCK: EVK-IRIS-W1-FC0_FC1_JTAG_UCX (J15.1), EVK-IRIS-W1-FTDI (R1.2), EVK-IRIS-W1-DEBUG INTERFACE (R119.2)
JTAG-TDI: EVK-IRIS-W1-FC0_FC1_JTAG_UCX (J35.1), EVK-IRIS-W1-FTDI (R3.2), EVK-IRIS-W1-DEBUG INTERFACE (R293.2)
JTAG-TDO: EVK-IRIS-W1-FC0_FC1_JTAG_UCX (J36.1), EVK-IRIS-W1-FTDI (R4.2), EVK-IRIS-W1-DEBUG INTERFACE (R291.2)
JTAG-TMS: EVK-IRIS-W1-FC0_FC1_JTAG_UCX (J34.1), EVK-IRIS-W1-FTDI (R5.2), EVK-IRIS-W1-DEBUG INTERFACE (R117.2)
LED_HEARTBEAT: EVK-IRIS-W1-MUCLINK (U13.87), EVK-IRIS-W1-MCULINK_USB_DCDC (LED5.1)
LED_SWO_ACT: EVK-IRIS-W1-MUCLINK (U13.2), EVK-IRIS-W1-MCULINK_USB_DCDC (LED2.1)
LED_USB_COMM: EVK-IRIS-W1-MUCLINK (U13.67), EVK-IRIS-W1-MCULINK_USB_DCDC (LED1.1)
LED_VCOM_ACT: EVK-IRIS-W1-MUCLINK (U13.82), EVK-IRIS-W1-MCULINK_USB_DCDC (LED4.1)
MDC: EVK-IRIS-W1-FC2_FC3_FC14_RMII (R263.1), EVK-IRIS-W1-RMII (R135.1 U1.12)
MDIO: EVK-IRIS-W1-FC2_FC3_FC14_RMII (R265.1), EVK-IRIS-W1-RMII (R133.1 U1.11)
MODUSB-D_n: EVK-IRIS-W1-PowerSchDoc (D11.1 J72.A7 J72.B7 TP141.1), EVK-IRIS-W1_MOD (C67.1 R51.1)
MODUSB-D_p: EVK-IRIS-W1-PowerSchDoc (D11.2 J72.A6 J72.B6 TP142.1), EVK-IRIS-W1_MOD (C68.1 R50.1)
MUSB-ID: EVK-IRIS-W1-PowerSchDoc (7 pins), EVK-IRIS-W1_MOD (J38.F2)
NetJ56_1: EVK-IRIS-W1-FC2_FC3_FC14_RMII (J56.1), EVK-IRIS-W1-MCULINK-MUX (U17.2)
NetJ57_1: EVK-IRIS-W1-FC2_FC3_FC14_RMII (J57.1), EVK-IRIS-W1-MCULINK-MUX (U17.1)
PDn: EVK-IRIS-W1-PIN-HEADERS_SDIO-HEADER (J43.9), EVK-IRIS-W1_MOD (R222.1), EVK-IRIS-W1-SRAM_RESET_STRAPING (R14.1 R15.2)
PHY_RESET: EVK-IRIS-W1_MOD (R210.1), EVK-IRIS-W1-RMII (C42.1 R152.1 U1.32)
PIO0_5-ISP_EN-LED_SWD_ACT: EVK-IRIS-W1-MUCLINK (R179.1 R181.2 R182.1 U13.88), EVK-IRIS-W1-MCULINK_USB_DCDC (LED3.1)
QSPI-RCE: EVK-IRIS-W1_MOD (J38.A5), EVK-IRIS-W1-SRAM_RESET_STRAPING (U2.1)
QSPI-RCLK: EVK-IRIS-W1_MOD (J38.A2), EVK-IRIS-W1-SRAM_RESET_STRAPING (U2.6)
QSPI-RD0: EVK-IRIS-W1_MOD (J38.B4), EVK-IRIS-W1-SRAM_RESET_STRAPING (U2.5)
QSPI-RD1: EVK-IRIS-W1_MOD (J38.A4), EVK-IRIS-W1-SRAM_RESET_STRAPING (U2.2)
QSPI-RD2: EVK-IRIS-W1_MOD (J38.B3), EVK-IRIS-W1-SRAM_RESET_STRAPING (U2.3)
QSPI-RD3: EVK-IRIS-W1_MOD (J38.A3), EVK-IRIS-W1-SRAM_RESET_STRAPING (U2.7)
QSPI-RDQS: EVK-IRIS-W1-PIN-HEADERS_SDIO-HEADER (J10.8), EVK-IRIS-W1_MOD (J38.D3)
RESETn: EVK-IRIS-W1-FC0_FC1_JTAG_UCX (J37.1), EVK-IRIS-W1-FTDI (R6.2), EVK-IRIS-W1-PIN-HEADERS_SDIO-HEADER (J47.8), EVK-IRIS-W1-PowerSchDoc (R40.2), EVK-IRIS-W1_MikroBuses (R10.1 R11.1 R46.1 R67.1), EVK-IRIS-W1-DEBUG INTERFACE (R44.2), EVK-IRIS-W1-SRAM_RESET_STRAPING (7 pins)
RF-CNT-0: EVK-IRIS-W1-PIN-HEADERS_SDIO-HEADER (J70.10), EVK-IRIS-W1_MOD (J38.B6), EVK-IRIS-W1-SRAM_RESET_STRAPING (R26.1 SW8.1)
RF-CNT-1: EVK-IRIS-W1-PIN-HEADERS_SDIO-HEADER (J70.7), EVK-IRIS-W1_MOD (J38.B7), EVK-IRIS-W1-SRAM_RESET_STRAPING (R18.1 SW8.4)
RF-CNT-2: EVK-IRIS-W1-PIN-HEADERS_SDIO-HEADER (J70.9), EVK-IRIS-W1_MOD (J38.A7), EVK-IRIS-W1-SRAM_RESET_STRAPING (R25.1 SW8.2)
RF-CNT-3: EVK-IRIS-W1-PIN-HEADERS_SDIO-HEADER (J70.8), EVK-IRIS-W1_MOD (J38.A8), EVK-IRIS-W1-SRAM_RESET_STRAPING (R20.1 SW8.3)
RFECLK: EVK-IRIS-W1-FC2_FC3_FC14_RMII (R279.1), EVK-IRIS-W1-RMII (U1.9)
RMII-RxD0: EVK-IRIS-W1-FC2_FC3_FC14_RMII (R272.1), EVK-IRIS-W1-RMII (R138.1)
RMII-RxD1: EVK-IRIS-W1-FC2_FC3_FC14_RMII (R268.1), EVK-IRIS-W1-RMII (R139.1)
RMII-RxERR: EVK-IRIS-W1-FC2_FC3_FC14_RMII (R285.1), EVK-IRIS-W1-RMII (R141.1)
RMII-TxD0: EVK-IRIS-W1-FC2_FC3_FC14_RMII (R275.1), EVK-IRIS-W1-RMII (U1.24)
RMII-TxD1: EVK-IRIS-W1-FC2_FC3_FC14_RMII (R276.1), EVK-IRIS-W1-RMII (U1.25)
RMII-TxEN: EVK-IRIS-W1-FC2_FC3_FC14_RMII (R280.1), EVK-IRIS-W1-RMII (U1.23)
SDIO-CLK: EVK-IRIS-W1-FC2_FC3_FC14_RMII (J55.3), EVK-IRIS-W1-PIN-HEADERS_SDIO-HEADER (R100.1)
SDIO-CMD: EVK-IRIS-W1-FC2_FC3_FC14_RMII (J57.3), EVK-IRIS-W1-PIN-HEADERS_SDIO-HEADER (R98.1)
SDIO-D0: EVK-IRIS-W1-FC2_FC3_FC14_RMII (J58.3), EVK-IRIS-W1-PIN-HEADERS_SDIO-HEADER (R101.1)
SDIO-D1: EVK-IRIS-W1-FC2_FC3_FC14_RMII (J59.3), EVK-IRIS-W1-PIN-HEADERS_SDIO-HEADER (R102.1)
SDIO-D3: EVK-IRIS-W1-FC2_FC3_FC14_RMII (J56.3), EVK-IRIS-W1-PIN-HEADERS_SDIO-HEADER (R97.1)
USB-D_n: EVK-IRIS-W1-FTDI (R28.2), EVK-IRIS-W1-PowerSchDoc (D14.1 J98.A7 J98.B7 TP111.1)
USB-D_p: EVK-IRIS-W1-FTDI (R24.2), EVK-IRIS-W1-PowerSchDoc (D14.2 J98.A6 J98.B6 TP112.1)

## Assembly variants
EVK-IRIS-W106: not fitted C1 C2 C3 C4 C5 C6 C8 C24 C34 C38 C47 C71 C72 C84 C85 C89 C90 C99 C100 C101 C112 C113 C114 J1 J6 J8 J9 J12 J13 J21 J22 J23 J24 J29 J30 J42 R10 R11 R13 R15 R18 R19 R20 R21 R25 R26 R27 R32 R33 R34 R36 R40 R46 R47 R48 R49 R67 R68 R70 R71 R91 R92 R104 R105 R107 R109 R112 R115 R116 R121 R122 R124 R125 R126 R128 R134 R136 R142 R143 R145 R155 R156 R160 R161 R165 R166 R167 R172 R177 R182 R185 R188 R189 R190 R194 R195 R201 R208 R211 R212 R213 R214 R215 R216 R217 R218 R219 R220 R221 R223 R224 R227 R228 R229 R230 R231 R232 R233 R234 R235 R236 R237 R238 R239 R240 R241 R242 R243 R245 R246 R247 R248 R250 R251 R253 R255 R258 R259 R261 R264 R266 R267 R269 R270 R271 R273 R274 R277 R278 R282 R283 R284 R286 R287 R290 R292 R294 R296 SW7 U2 U9 U109